# Altium project ESP32_DevBoard_T.PrjPcb
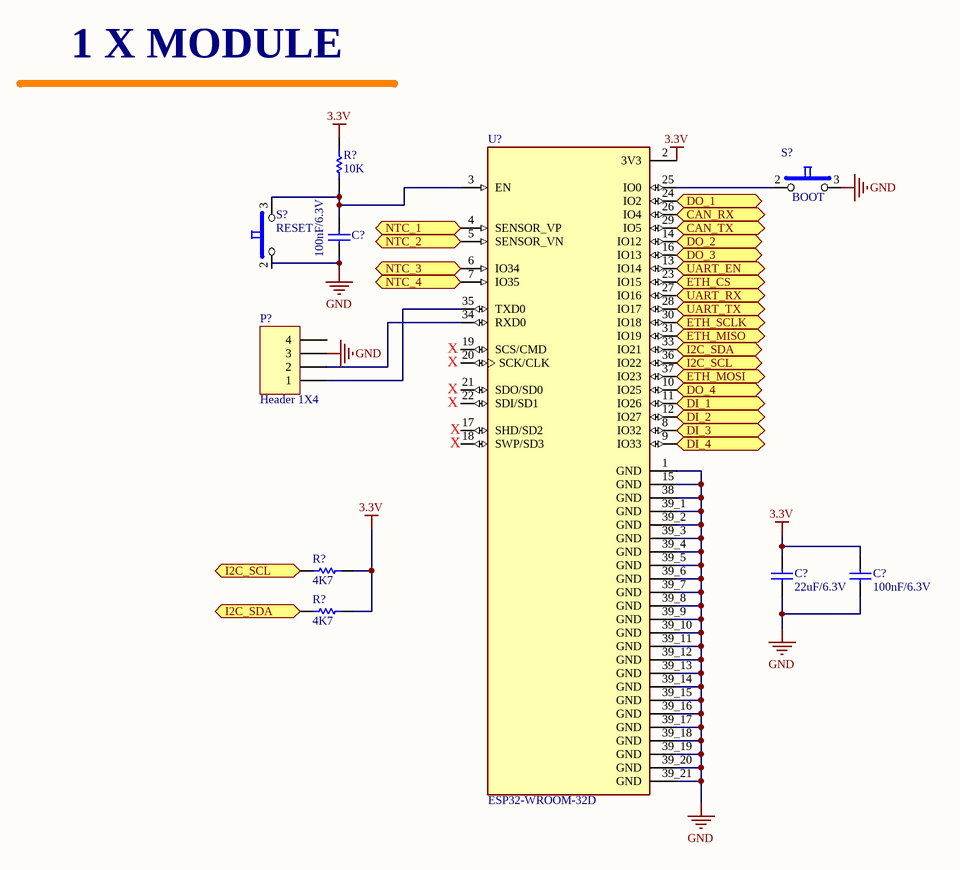
[diagram p0: Module_Esp32.SchDoc]
5 sheets, 33 parts. Net scope: flat (ports and power ports of the same name join across sheets).
Sheets:
  Module_Esp32.SchDoc
  Input_Analog.SchDoc
  Connector.SchDoc
  Peripheral.SchDoc
  Communication.SchDoc

## Sheet Module_Esp32.SchDoc
size A4

### Parts
(Parts that share a designator on the sheet are numbered #1, #2 ... from top to bottom, then left to right.)
C?#1  100nF/6.3V  [CAP0603W]
C?#2  22uF/6.3V  [CAP0603W]
C?#3  100nF/6.3V  [CAP0603W]
P?#1  Header 1X4  [HDR1X4]
R?#1  10K  [RES1608[0603]]
R?#2  4K7  [RES1608[0603]]
R?#3  4K7  [RES1608[0603]]
S?#1  BOOT  [BUTTON TACT 6.2x7. 3.85MM 100gf 90C]
S?#2  RESET  [BUTTON TACT 6.2x7. 3.85MM 100gf 90C]
U?#1  ESP32-WROOM-32D  [MODULE_ESP32-WROOM-32D]

### Ports
CAN_RX, CAN_TX, DI_1, DI_2, DI_3, DI_4, DO_1, DO_2, DO_3, DO_4, ETH_CS, ETH_MISO, ETH_MOSI, ETH_SCLK, I2C_SCL, I2C_SDA, NTC_1, NTC_2, NTC_3, NTC_4, UART_EN, UART_RX, UART_TX

### Nets
3.3V: C?#2.1 C?#3.1 R?#1.1 R?#2.1 R?#3.1 U?#1.2(3V3)
GND: C?#1.2 C?#2.2 C?#3.2 P?#1.3 S?#1.3 S?#2.2 U?#1.1(GND) U?#1.15(GND) U?#1.38(GND) U?#1.39_1(GND) U?#1.39_2(GND) U?#1.39_3(GND) U?#1.39_4(GND) U?#1.39_5(GND) U?#1.39_6(GND) U?#1.39_7(GND) U?#1.39_8(GND) U?#1.39_9(GND) U?#1.39_10(GND) U?#1.39_11(GND) U?#1.39_12(GND) U?#1.39_13(GND) U?#1.39_14(GND) U?#1.39_15(GND) U?#1.39_16(GND) U?#1.39_17(GND) U?#1.39_18(GND) U?#1.39_19(GND) U?#1.39_20(GND) U?#1.39_21(GND)
NetC?#1_1: C?#1.1 R?#1.2 S?#2.3 U?#1.3(EN)
NetC?#4_1: U?#1.4(SENSOR_VP) ; port NTC_1
NetC?#5_1: U?#1.5(SENSOR_VN) ; port NTC_2
NetC?#6_1: U?#1.7(IO35) ; port NTC_4
NetC?#7_1: U?#1.6(IO34) ; port NTC_3
NetH?_3: U?#1.37(IO23) ; port ETH_MOSI
NetH?_4: U?#1.30(IO18) ; port ETH_SCLK
NetH?_5: U?#1.23(IO15) ; port ETH_CS
NetH?_12: U?#1.31(IO19) ; port ETH_MISO
NetP?#1_1: P?#1.1 U?#1.35(TXD0)
NetP?#1_2: P?#1.2 U?#1.34(RXD0)
NetP?#2_5: U?#1.11(IO26) ; port DI_1
NetP?#2_6: U?#1.24(IO2) ; port DO_1
NetP?#2_7: U?#1.12(IO27) ; port DI_2
NetP?#2_8: U?#1.14(IO12) ; port DO_2
NetP?#2_9: U?#1.8(IO32) ; port DI_3
NetP?#2_10: U?#1.16(IO13) ; port DO_3
NetP?#2_11: U?#1.9(IO33) ; port DI_4
NetP?#2_12: U?#1.10(IO25) ; port DO_4
NetP?#3_3: R?#2.2 U?#1.36(IO22) ; port I2C_SCL
NetP?#3_4: R?#3.2 U?#1.33(IO21) ; port I2C_SDA
NetS?#1_2: S?#1.2 U?#1.25(IO0)
NetU?#1_13: U?#1.13(IO14) ; port UART_EN
NetU?#1_26: U?#1.26(IO4) ; port CAN_RX
NetU?#1_27: U?#1.27(IO16) ; port UART_RX
NetU?#1_28: U?#1.28(IO17) ; port UART_TX
NetU?#1_29: U?#1.29(IO5) ; port CAN_TX

Not connected (* = marked no-connect by the designer): P?#1 4; U?#1 17(SHD/SD2) 18(SWP/SD3) 19(SCS/CMD) 20(SCK/CLK) 21(SDO/SD0) 22(SDI/SD1)

### Notes on the sheet
- 1 X MODULE
- (near U?#1) X

### Library data of the parts
C?#1-C?#3 = CAP1: CAPACITOR Capacitor Semiconductor; Value: 100nF; Published: 8-Jun-2000; LatestRevisionDate: 17-Jul-2002; LatestRevisionNote: Re-released for DXP Platform.; PackageReference: C1206; Publisher: Altium Limited
P?#1 = Header 1X4: Header, 4-Pin; LatestRevisionDate: 17-Jul-2002; LatestRevisionNote: Re-released for DXP Platform.; Publisher: Altium Limited
R?#1-R?#3 = RES: RESISTOR 0603 Case %1; Value: 430R; Published: 8-Jun-2000; LatestRevisionDate: 17-Jul-2002; LatestRevisionNote: Re-released for DXP Platform.; PackageReference: AXIAL-0.5; Publisher: Altium Limited
S?#1 S?#2 = BUTTON_DIP: SWITCH TACT 6.2x7. 3.85MM 100gf 90C
U?#1 = ESP32-WROOM-32D: Bluetooth, WiFi 802.11b/g/n, Bluetooth v4.2 +EDR, Class 1, 2 and 3 Transceiver Module 2.4GHz ~ 2.5GHz Integrated; MF: Espressif Systems; Price: None; Availability: In Stock; Package: Module Espressif Systems; MP: ESP32-WROOM-32D; Value: *; SnapEDA_Link: https://www.snapeda.com/parts/ESP32-WROOM-32D/Espressif+Systems/view-part/?ref=snap; Purchase-URL: https://pricing.snapeda.com/search/part/ESP32-WROOM-32D/?ref=eda; Check_prices: https://www.snapeda.com/parts/ESP32-WROOM-32D/Espressif+Systems/view-part/?ref=eda

## Sheet Input_Analog.SchDoc
size A4
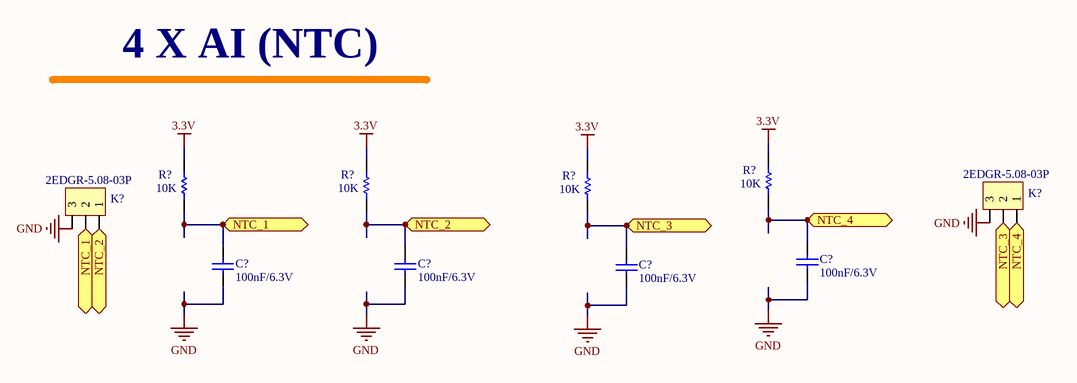
[diagram p1: Input_Analog.SchDoc]

### Parts
(Parts that share a designator on the sheet are numbered #1, #2 ... from top to bottom, then left to right.)
C?#4  100nF/6.3V  [CAP0603W]
C?#5  100nF/6.3V  [CAP0603W]
C?#6  100nF/6.3V  [CAP0603W]
C?#7  100nF/6.3V  [CAP0603W]
K?#1  2EDGR-5.08-03P  [CON_DG129_03P]
K?#2  2EDGR-5.08-03P  [CON_DG129_03P]
R?#4  10K  [RES1608[0603]]
R?#5  10K  [RES1608[0603]]
R?#6  10K  [RES1608[0603]]
R?#7  10K  [RES1608[0603]]

### Ports
NTC_1, NTC_2, NTC_3, NTC_4

### Nets
3.3V: R?#4.1 R?#5.1 R?#6.1 R?#7.1
GND: C?#4.2 C?#5.2 C?#6.2 C?#7.2 K?#1.3 K?#2.3
NetC?#4_1: C?#4.1 K?#2.2 R?#4.2 ; port NTC_1
NetC?#5_1: C?#5.1 K?#2.1 R?#5.2 ; port NTC_2
NetC?#6_1: C?#6.1 K?#1.1 R?#6.2 ; port NTC_4
NetC?#7_1: C?#7.1 K?#1.2 R?#7.2 ; port NTC_3

### Notes on the sheet
- 4 X AI (NTC)

### Library data of the parts
C?#4-C?#7 = CAP1: CAPACITOR 0603 Case; Value: 100nF; Published: 8-Jun-2000; LatestRevisionDate: 17-Jul-2002; LatestRevisionNote: Re-released for DXP Platform.; PackageReference: C1206; Publisher: Altium Limited
K?#1 K?#2 = KLEMENS_3P: CONNECTOR 5.08mm 3PIN 90DEG
R?#4-R?#7 = RES: RESISTOR 0603 Case %1; Value: 430R; Published: 8-Jun-2000; LatestRevisionDate: 17-Jul-2002; LatestRevisionNote: Re-released for DXP Platform.; PackageReference: AXIAL-0.5; Publisher: Altium Limited

## Sheet Connector.SchDoc
size A4
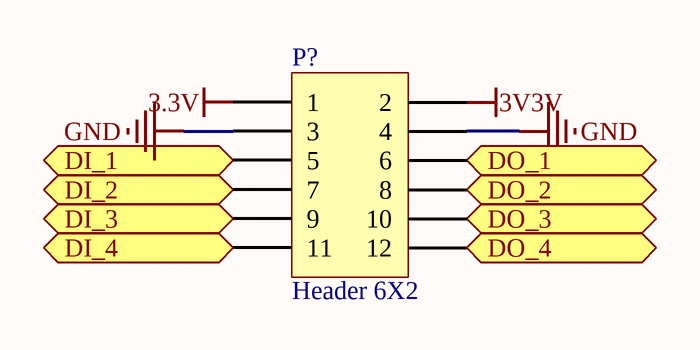
[diagram p2: Connector.SchDoc]

### Parts
(Parts that share a designator on the sheet are numbered #1, #2 ... from top to bottom, then left to right.)
P?#2  Header 6X2  [HDR2X6]

### Ports
DI_1, DI_2, DI_3, DI_4, DO_1, DO_2, DO_3, DO_4

### Nets
3.3V: P?#2.1
3V3V: P?#2.2
GND: P?#2.3 P?#2.4
NetP?#2_5: P?#2.5 ; port DI_1
NetP?#2_6: P?#2.6 ; port DO_1
NetP?#2_7: P?#2.7 ; port DI_2
NetP?#2_8: P?#2.8 ; port DO_2
NetP?#2_9: P?#2.9 ; port DI_3
NetP?#2_10: P?#2.10 ; port DO_3
NetP?#2_11: P?#2.11 ; port DI_4
NetP?#2_12: P?#2.12 ; port DO_4

### Library data of the parts
P?#2 = Header 6X2: CONNECTOR Header, 6-Pin, Dual row; LatestRevisionDate: 17-Jul-2002; LatestRevisionNote: Re-released for DXP Platform.; Publisher: Altium Limited

## Sheet Peripheral.SchDoc
size A4
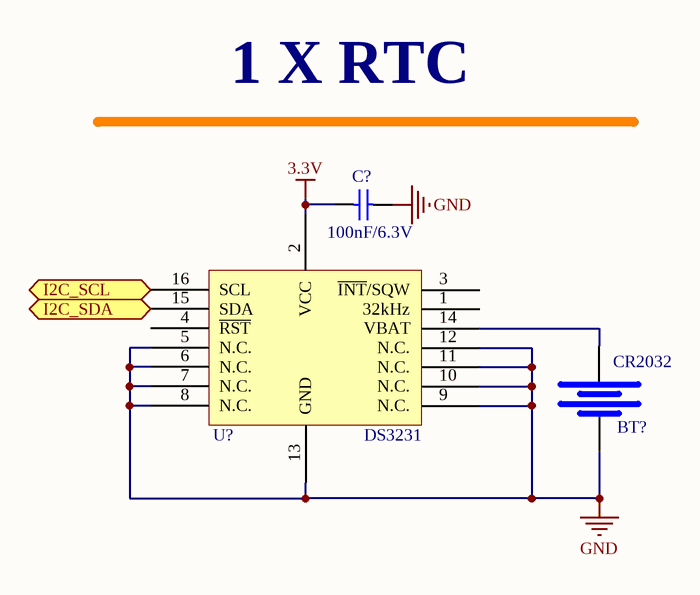
[diagram p3: Peripheral.SchDoc]

### Parts
(Parts that share a designator on the sheet are numbered #1, #2 ... from top to bottom, then left to right.)
BT?  CR2032  [CR2032]
C?#8  100nF/6.3V  [CAP0603W]
U?#2  DS3231  [SOIC16]

### Ports
I2C_SCL, I2C_SDA

### Nets
3.3V: C?#8.1 U?#2.2(VCC)
GND: BT?.2(-) C?#8.2 U?#2.5(N.C.) U?#2.6(N.C.) U?#2.7(N.C.) U?#2.8(N.C.) U?#2.9(N.C.) U?#2.10(N.C.) U?#2.11(N.C.) U?#2.12(N.C.) U?#2.13(GND)
NetBT?_1: BT?.1(+) U?#2.14(VBAT)
NetP?#3_3: U?#2.16(SCL) ; port I2C_SCL
NetP?#3_4: U?#2.15(SDA) ; port I2C_SDA

Not connected (* = marked no-connect by the designer): U?#2 1(32kHz) 3(~{INT}/SQW) 4(~{RST})

### Notes on the sheet
- 1 X RTC

### Library data of the parts
BT? = BATTERY_CR2032: BATTERY CR2032 HORIZONTAL 3PIN
C?#8 = CAP1: CAPACITOR 0603 Case; Value: 100nF; Published: 8-Jun-2000; LatestRevisionDate: 17-Jul-2002; LatestRevisionNote: Re-released for DXP Platform.; PackageReference: C1206; Publisher: Altium Limited
U?#2 = RTC_DS3231: IC DS3231SN RTC W/TCXO 16-SOIC MAXIM

## Sheet Communication.SchDoc
size A4
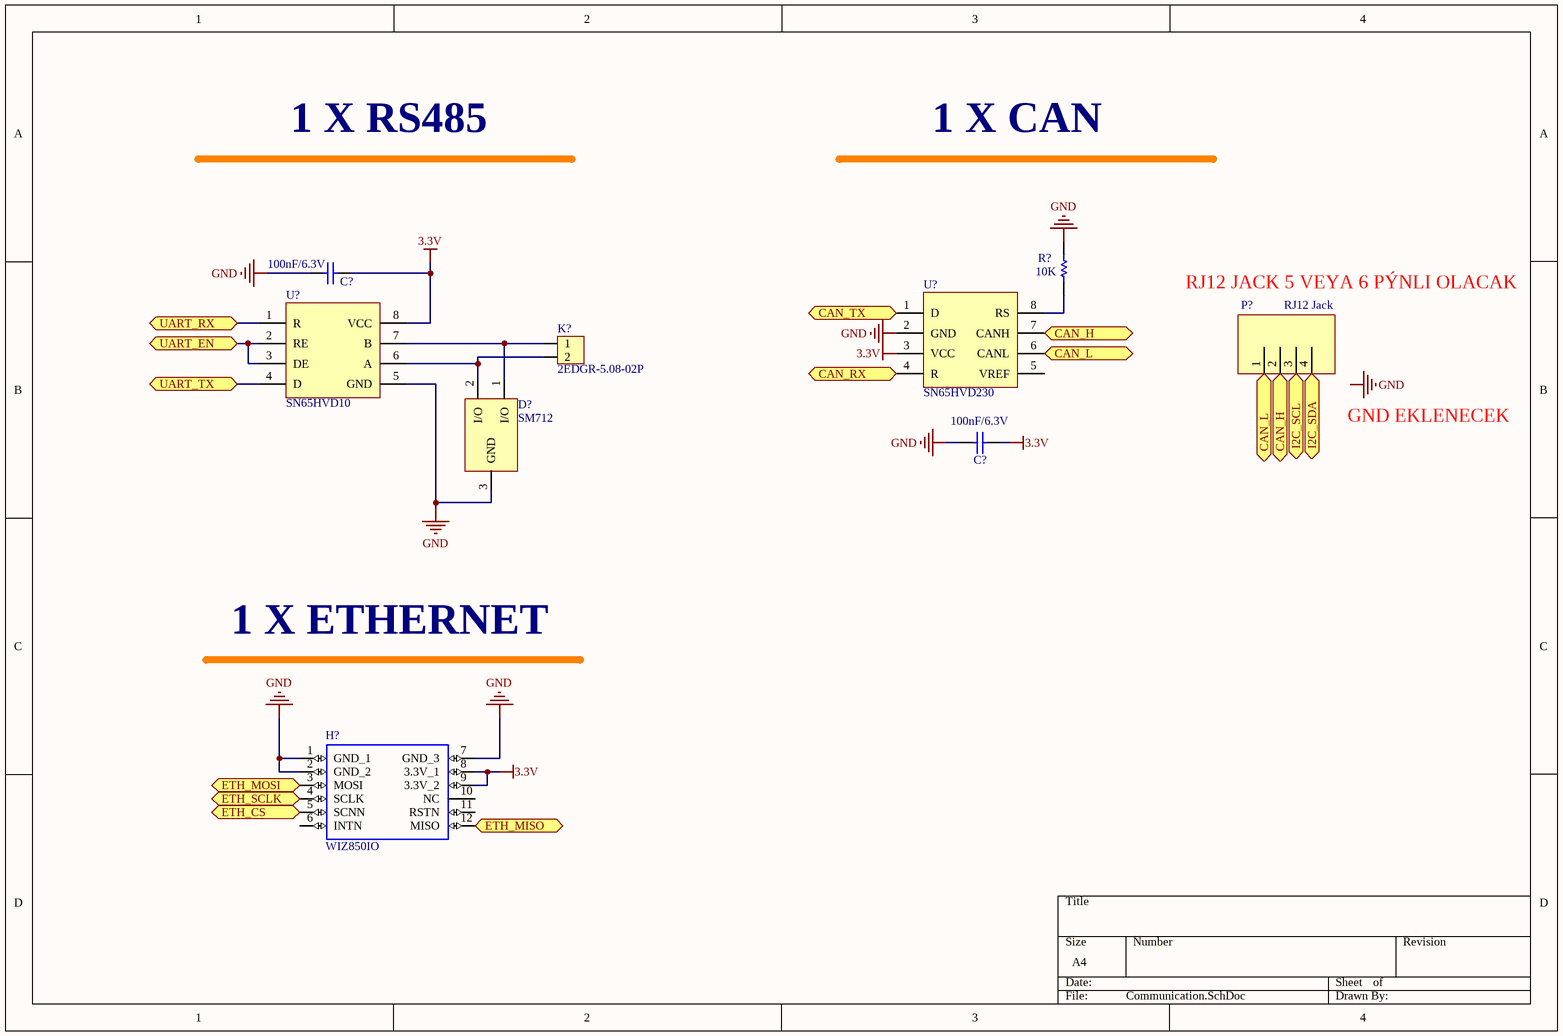
[diagram p4: Communication.SchDoc]

### Parts
(Parts that share a designator on the sheet are numbered #1, #2 ... from top to bottom, then left to right.)
C?#9  100nF/6.3V  [CAP0603W]
C?#10  100nF/6.3V  [CAP0603W]
D?  SM712  [SOT23 - BC8X6]
H?  WIZ850IO  [WIZ850IO]
K?#3  2EDGR-5.08-02P  [CON_DG129_02P]
P?#3  RJ12 Jack  [rj12_90deg_con_4p4c]
R?#8  10K  [RES1608[0603]]
U?#3  SN65HVD230  [SO8]
U?#4  SN65HVD10  [SO8]

### Ports
CAN_H, CAN_L, CAN_RX, CAN_TX, ETH_CS, ETH_MISO, ETH_MOSI, ETH_SCLK, I2C_SCL, I2C_SDA, UART_EN, UART_RX, UART_TX

### Nets
3.3V: C?#9.2 C?#10.2 H?.8(3.3V_1) H?.9(3.3V_2) U?#3.3(VCC) U?#4.8(VCC)
GND: C?#9.1 C?#10.1 D?.3(GND) H?.1(GND_1) H?.2(GND_2) H?.7(GND_3) R?#8.1 U?#3.2(GND) U?#4.5(GND)
NetD?_1: D?.1(I/O) K?#3.1 U?#4.7(B)
NetD?_2: D?.2(I/O) K?#3.2 U?#4.6(A)
NetH?_3: H?.3(MOSI) ; port ETH_MOSI
NetH?_4: H?.4(SCLK) ; port ETH_SCLK
NetH?_5: H?.5(SCNN) ; port ETH_CS
NetH?_12: H?.12(MISO) ; port ETH_MISO
NetP?#3_1: P?#3.1 U?#3.6(CANL) ; port CAN_L
NetP?#3_2: P?#3.2 U?#3.7(CANH) ; port CAN_H
NetP?#3_3: P?#3.3 ; port I2C_SCL
NetP?#3_4: P?#3.4 ; port I2C_SDA
NetR?#8_2: R?#8.2 U?#3.8(RS)
NetU?#1_13: U?#4.2(RE) U?#4.3(DE) ; port UART_EN
NetU?#1_26: U?#3.4(R) ; port CAN_RX
NetU?#1_27: U?#4.1(R) ; port UART_RX
NetU?#1_28: U?#4.4(D) ; port UART_TX
NetU?#1_29: U?#3.1(D) ; port CAN_TX

Not connected (* = marked no-connect by the designer): H? 6(INTN) 10(NC) 11(RSTN); U?#3 5(VREF)

### Notes on the sheet
- 1 X RS485
- 1 X CAN
- (near P?#3) RJ12 JACK 5 VEYA 6 PÝNLI OLACAK
- GND EKLENECEK
- 1 X ETHERNET
- Labels drawn without touching a wire or pin: GND

### Library data of the parts
C?#9 C?#10 = CAP1: CAPACITOR 0603 Case; Value: 100nF; Published: 8-Jun-2000; LatestRevisionDate: 17-Jul-2002; LatestRevisionNote: Re-released for DXP Platform.; PackageReference: C1206; Publisher: Altium Limited
D? = SM712: DIODE TVS Array For Rs485
H? = WIZ850IO: Ethernet - 10/100 Base-T/TX PHY SPI Interface Module; MF: WIZnet; Value: *; Package: Module WIZnet; Availability: In Stock; Check_prices: https://www.snapeda.com/parts/WIZ850IO/WIZnet/view-part/?ref=eda; SnapEDA_Link: https://www.snapeda.com/parts/WIZ850IO/WIZnet/view-part/?ref=snap; Purchase-URL: https://pricing.snapeda.com/search/part/WIZ850IO/?ref=eda; MP: WIZ850IO; Price: None
K?#3 = KLEMENS_2P: CONNECTOR 5.08mm 2PIN 90DEG
P?#3 = RJ12_4P4C: CONNECTOR RJ12 Jack, 90 Degree
R?#8 = RES: RESISTOR 0603 Case %1; Value: 430R; Published: 8-Jun-2000; LatestRevisionDate: 17-Jul-2002; LatestRevisionNote: Re-released for DXP Platform.; PackageReference: AXIAL-0.5; Publisher: Altium Limited
U?#3 = SN65HVD230: CAN Interface IC 3.3V CAN Transceiver; Published: 24-Aug-2001; LatestRevisionDate: 6-Jun-2005; LatestRevisionNote: Stylized 3D Model Added.; DatasheetDocument: Feb-1998; PackageDocument: Aug-1999; PackageReference: SO8W; Publisher: Altium Limited; ComponentLink1Description: Manufacturer Link; ComponentLink1URL: http://www.st.com/
U?#4 = 75176: IC SN65HVD10DR SMD SOIC8; Published: 24-Aug-2001; LatestRevisionDate: 6-Jun-2005; LatestRevisionNote: Stylized 3D Model Added.; DatasheetDocument: Feb-1998; PackageDocument: Aug-1999; PackageReference: SO8W; Publisher: Altium Limited; ComponentLink1Description: Manufacturer Link; ComponentLink1URL: http://www.st.com/

## Nets that join several sheets
3.3V: Module_Esp32 (6 pins), Input_Analog (R?#4.1 R?#5.1 R?#6.1 R?#7.1), Connector (P?#2.1), Peripheral (C?#8.1 U?#2.2), Communication (6 pins)
GND: Module_Esp32 (30 pins), Input_Analog (6 pins), Connector (P?#2.3 P?#2.4), Peripheral (11 pins), Communication (9 pins)
NetC?#4_1: Module_Esp32 (U?#1.4), Input_Analog (C?#4.1 K?#2.2 R?#4.2)
NetC?#5_1: Module_Esp32 (U?#1.5), Input_Analog (C?#5.1 K?#2.1 R?#5.2)
NetC?#6_1: Module_Esp32 (U?#1.7), Input_Analog (C?#6.1 K?#1.1 R?#6.2)
NetC?#7_1: Module_Esp32 (U?#1.6), Input_Analog (C?#7.1 K?#1.2 R?#7.2)
NetH?_3: Module_Esp32 (U?#1.37), Communication (H?.3)
NetH?_4: Module_Esp32 (U?#1.30), Communication (H?.4)
NetH?_5: Module_Esp32 (U?#1.23), Communication (H?.5)
NetH?_12: Module_Esp32 (U?#1.31), Communication (H?.12)
NetP?#2_5: Module_Esp32 (U?#1.11), Connector (P?#2.5)
NetP?#2_6: Module_Esp32 (U?#1.24), Connector (P?#2.6)
NetP?#2_7: Module_Esp32 (U?#1.12), Connector (P?#2.7)
NetP?#2_8: Module_Esp32 (U?#1.14), Connector (P?#2.8)
NetP?#2_9: Module_Esp32 (U?#1.8), Connector (P?#2.9)
NetP?#2_10: Module_Esp32 (U?#1.16), Connector (P?#2.10)
NetP?#2_11: Module_Esp32 (U?#1.9), Connector (P?#2.11)
NetP?#2_12: Module_Esp32 (U?#1.10), Connector (P?#2.12)
NetP?#3_3: Module_Esp32 (R?#2.2 U?#1.36), Peripheral (U?#2.16), Communication (P?#3.3)
NetP?#3_4: Module_Esp32 (R?#3.2 U?#1.33), Peripheral (U?#2.15), Communication (P?#3.4)
NetU?#1_13: Module_Esp32 (U?#1.13), Communication (U?#4.2 U?#4.3)
NetU?#1_26: Module_Esp32 (U?#1.26), Communication (U?#3.4)
NetU?#1_27: Module_Esp32 (U?#1.27), Communication (U?#4.1)
NetU?#1_28: Module_Esp32 (U?#1.28), Communication (U?#4.4)
NetU?#1_29: Module_Esp32 (U?#1.29), Communication (U?#3.1)